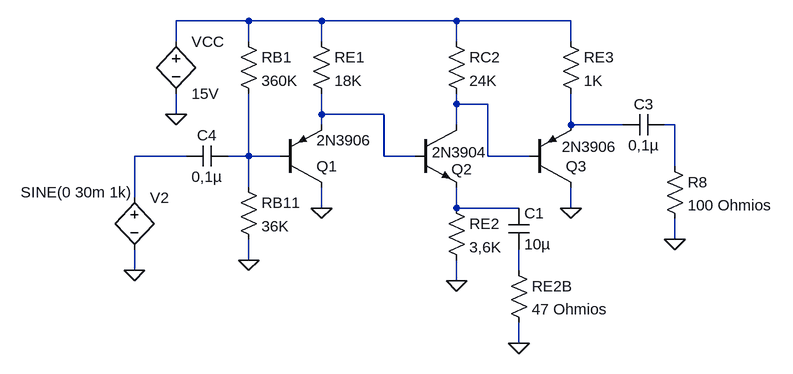
[diagram p0: schematic circuito_grande.asc]
circuito_grande.asc, the LTspice schematic file:
Version 4
SHEET 1 880 680
WIRE -16 -64 -128 -64
WIRE 96 -64 -16 -64
WIRE 304 -64 96 -64
WIRE 480 -64 304 -64
WIRE -128 -32 -128 -64
WIRE -16 -32 -16 -64
WIRE 96 -32 96 -64
WIRE 304 -32 304 -64
WIRE 480 -32 480 -64
WIRE 304 64 304 48
WIRE 352 64 304 64
WIRE -128 80 -128 48
WIRE 96 80 96 48
WIRE 192 80 96 80
WIRE 96 96 96 80
WIRE 304 96 304 64
WIRE 480 96 480 48
WIRE 560 96 480 96
WIRE 640 96 624 96
WIRE -112 144 -192 144
WIRE -16 144 -16 48
WIRE -16 144 -48 144
WIRE 32 144 -16 144
WIRE 192 144 192 80
WIRE 240 144 192 144
WIRE 352 144 352 64
WIRE 416 144 352 144
WIRE 640 160 640 96
WIRE -16 192 -16 144
WIRE -192 208 -192 144
WIRE 96 224 96 192
WIRE 304 224 304 192
WIRE 400 224 304 224
WIRE 480 224 480 192
WIRE 640 272 640 240
WIRE -16 304 -16 272
WIRE -192 320 -192 288
WIRE 400 320 400 288
WIRE 304 336 304 304
WIRE 400 432 400 400
FLAG -192 320 0
FLAG -16 304 0
FLAG 96 224 0
FLAG 304 336 0
FLAG 400 432 0
FLAG 480 224 0
FLAG 640 272 0
FLAG -128 80 0
SYMBOL pnp 32 192 M180
WINDOW 3 56 72 Left 2
SYMATTR InstName Q1
SYMATTR Value 2N3906
SYMBOL pnp 416 192 M180
WINDOW 3 50 62 Left 2
SYMATTR InstName Q3
SYMATTR Value 2N3906
SYMBOL npn 240 96 R0
WINDOW 0 26 42 Left 2
SYMATTR InstName 2N3904
SYMATTR Value Q2
SYMBOL h -128 -48 R0
SYMATTR InstName VCC
SYMATTR Value 15V
SYMBOL h -192 192 R0
WINDOW 3 -175 8 Left 2
SYMATTR InstName V2
SYMATTR Value SINE(0 30m 1k)
SYMBOL res -32 176 R0
SYMATTR InstName RB11
SYMATTR Value 36K
SYMBOL res -32 -48 R0
SYMATTR InstName RB1
SYMATTR Value 360K
SYMBOL res 80 -48 R0
SYMATTR InstName RE1
SYMATTR Value 18K
SYMBOL res 288 -48 R0
SYMATTR InstName RC2
SYMATTR Value 24K
SYMBOL res 464 -48 R0
SYMATTR InstName RE3
SYMATTR Value 1K
SYMBOL res 288 208 R0
SYMATTR InstName RE2
SYMATTR Value 3,6K
SYMBOL res 384 304 R0
SYMATTR InstName RE2B
SYMATTR Value 47 Ohmios
SYMBOL res 624 144 R0
SYMATTR InstName R8
SYMATTR Value 100 Ohmios
SYMBOL cap -112 160 R270
WINDOW 0 32 32 VTop 2
WINDOW 3 0 32 VBottom 2
SYMATTR InstName C4
SYMATTR Value 0,1µ
SYMBOL cap 384 224 R0
SYMATTR InstName C1
SYMATTR Value 10µ
SYMBOL cap 560 112 R270
WINDOW 0 32 32 VTop 2
WINDOW 3 0 32 VBottom 2
SYMATTR InstName C3
SYMATTR Value 0,1µ

The netlist it stands for:
* circuito_grande.asc
Q1 0 N007 N003 0 2N3906
Q3 0 N002 N004 0 2N3906
Q§2N3904 N002 N003 N008 0 Q2
H§VCC N001 0 15V
H§V2 N006 0 SINE(0 30m 1k)
RB11 N007 0 36K
RB1 N001 N007 360K
RE1 N001 N003 18K
RC2 N001 N002 24K
RE3 N001 N004 1K
RE2 N008 0 3,6K
RE2B N009 0 47 Ohmios
R8 N005 0 100 Ohmios
C4 N006 N007 0,1µ
C1 N008 N009 10µ
C3 N004 N005 0,1µ
.model NPN NPN
.model PNP PNP
.lib standard.bjt
.backanno
.end